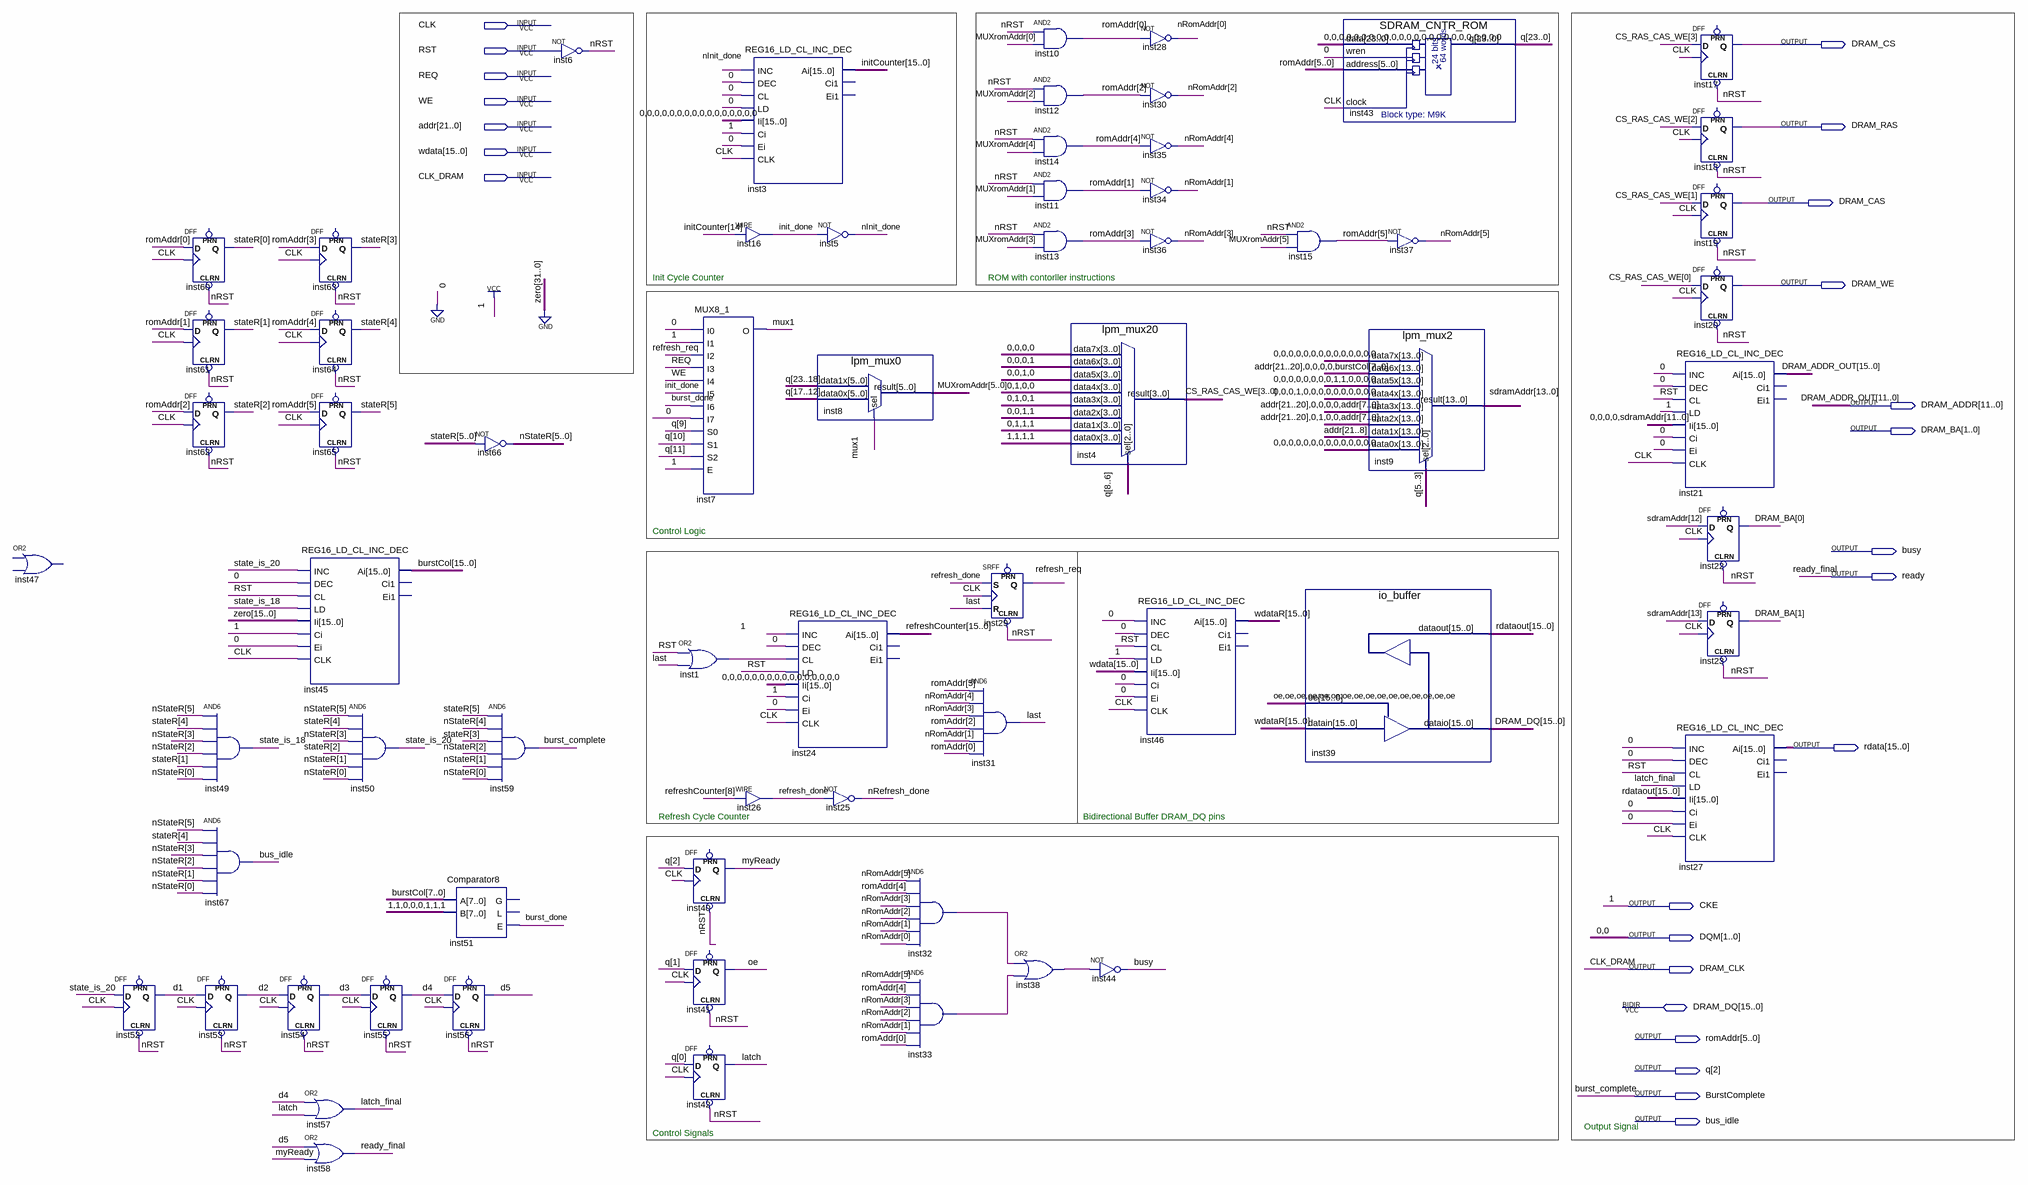
[diagram p0: schematic sheet]
// Quartus schematic SDRAM_CNTR.bdf as structural Verilog: 65 symbols, 24 pins
module SDRAM_CNTR (
  input  CLK,
  input  RST,
  input  REQ,
  input  WE,
  input  [21:0] addr,
  input  [15:0] wdata,
  input  CLK_DRAM,
  inout  [15:0] DRAM_DQ,
  output DRAM_CS,
  output DRAM_RAS,
  output DRAM_CAS,
  output DRAM_WE,
  output [11:0] DRAM_ADDR,
  output [1:0] DRAM_BA,
  output busy,
  output ready,
  output [15:0] rdata,
  output CKE,
  output [1:0] DQM,
  output DRAM_CLK,
  output [5:0] romAddr,
  output [23:0] q,
  output BurstComplete,
  output bus_idle
);

  wire burst_done, d1, d2, d3, d4, d5, init_done, inst1_out, inst32_out, inst33_out, inst38_out, last, latch,
       latch_final, mux1, myReady, nInit_done, nRefresh_done, nRST, oe, refresh_done, refresh_req,
       state_is_18, state_is_20;
  wire [3:0] CS_RAS_CAS_WE;
  wire [5:0] MUXromAddr, nRomAddr, nStateR, stateR;
  wire [13:0] sdramAddr;
  wire [15:0] burstCol, initCounter, rdataout, refreshCounter, wdataR;
  wire [15:12] DRAM_ADDR_OUT;

  // OR2 inst47 is placed but not wired
  DFF inst52 (.CLRN(nRST), .CLK(CLK), .D(state_is_20), .Q(d1));  // open: PRN
  DFF inst60 (.CLRN(nRST), .CLK(CLK), .D(romAddr[0]), .Q(stateR[0]));  // open: PRN
  DFF inst61 (.CLRN(nRST), .CLK(CLK), .D(romAddr[1]), .Q(stateR[1]));  // open: PRN
  DFF inst62 (.CLRN(nRST), .CLK(CLK), .D(romAddr[2]), .Q(stateR[2]));  // open: PRN
  and inst49 (state_is_18, nStateR[5], stateR[4], nStateR[3], nStateR[2], stateR[1], nStateR[0]);
  and inst67 (bus_idle, nStateR[5], stateR[4], nStateR[3], nStateR[2], nStateR[1], nStateR[0]);
  DFF inst53 (.CLRN(nRST), .CLK(CLK), .D(d1), .Q(d2));  // open: PRN
  DFF inst54 (.CLRN(nRST), .CLK(CLK), .D(d2), .Q(d3));  // open: PRN
  DFF inst63 (.CLRN(nRST), .CLK(CLK), .D(romAddr[3]), .Q(stateR[3]));  // open: PRN
  DFF inst64 (.CLRN(nRST), .CLK(CLK), .D(romAddr[4]), .Q(stateR[4]));  // open: PRN
  DFF inst65 (.CLRN(nRST), .CLK(CLK), .D(romAddr[5]), .Q(stateR[5]));  // open: PRN
  REG16_LD_CL_INC_DEC inst45 (
    .INC(state_is_20), .DEC(1'b0), .CL(RST), .LD(state_is_18), .Ii({16{1'b0}}), .Ci(1'b1), .Ei(1'b0),
    .CLK(CLK), .Ai(burstCol));  // open: Ci1, Ei1
  or inst57 (latch_final, d4, latch);
  or inst58 (ready, d5, myReady);
  and inst50 (state_is_20, nStateR[5], stateR[4], nStateR[3], stateR[2], nStateR[1], nStateR[0]);
  DFF inst55 (.CLRN(nRST), .CLK(CLK), .D(d3), .Q(d4));  // open: PRN
  assign nStateR = ~stateR;  // NOT inst66, 6 bits wide
  and inst59 (BurstComplete, stateR[5], nStateR[4], stateR[3], nStateR[2], nStateR[1], nStateR[0]);
  Comparator8 inst51 (.A(burstCol[7:0]), .B(8'b11000111), .E(burst_done));  // open: G, L
  DFF inst56 (.CLRN(nRST), .CLK(CLK), .D(d4), .Q(d5));  // open: PRN
  not inst6 (nRST, RST);
  MUX8_1 inst7 (
    .I0(1'b0), .I1(1'b1), .I2(refresh_req), .I3(REQ), .I4(WE), .I5(init_done), .I6(burst_done), .I7(1'b0),
    .S0(q[9]), .S1(q[10]), .S2(q[11]), .E(1'b1), .O(mux1));
  or inst1 (inst1_out, RST, last);
  DFF inst40 (.CLRN(nRST), .CLK(CLK), .D(q[2]), .Q(myReady));  // open: PRN
  DFF inst41 (.CLRN(nRST), .CLK(CLK), .D(q[1]), .Q(oe));  // open: PRN
  DFF inst42 (.CLRN(nRST), .CLK(CLK), .D(q[0]), .Q(latch));  // open: PRN
  REG16_LD_CL_INC_DEC inst3 (
    .INC(nInit_done), .DEC(1'b0), .CL(1'b0), .LD(1'b0), .Ii({16{1'b0}}), .Ci(1'b1), .Ei(1'b0), .CLK(CLK),
    .Ai(initCounter));  // open: Ci1, Ei1
  assign init_done = initCounter[14];  // WIRE inst16
  assign refresh_done = refreshCounter[8];  // WIRE inst26
  REG16_LD_CL_INC_DEC inst24 (
    .INC(1'b1), .DEC(1'b0), .CL(inst1_out), .LD(RST), .Ii({16{1'b0}}), .Ci(1'b1), .Ei(1'b0), .CLK(CLK),
    .Ai(refreshCounter));  // open: Ci1, Ei1
  not inst5 (nInit_done, init_done);
  lpm_mux0 inst8 (.data1x(q[23:18]), .data0x(q[17:12]), .sel(mux1), .result(MUXromAddr));
  not inst25 (nRefresh_done, refresh_done);
  and inst32 (inst32_out, nRomAddr[5], romAddr[4], nRomAddr[3], nRomAddr[2], nRomAddr[1], nRomAddr[0]);
  and inst33 (inst33_out, nRomAddr[5], romAddr[4], nRomAddr[3], nRomAddr[2], nRomAddr[1], romAddr[0]);
  SRFF inst29 (.CLRN(nRST), .S(refresh_done), .R(last), .CLK(CLK), .Q(refresh_req));  // open: PRN
  and inst31 (last, romAddr[5], nRomAddr[4], nRomAddr[3], romAddr[2], nRomAddr[1], romAddr[0]);
  and inst10 (romAddr[0], nRST, MUXromAddr[0]);
  and inst12 (romAddr[2], nRST, MUXromAddr[2]);
  and inst14 (romAddr[4], nRST, MUXromAddr[4]);
  and inst11 (romAddr[1], nRST, MUXromAddr[1]);
  and inst13 (romAddr[3], nRST, MUXromAddr[3]);
  or inst38 (inst38_out, inst32_out, inst33_out);
  lpm_mux20 inst4 (
    .data7x(4'b0000), .data6x(4'b0001), .data5x(4'b0010), .data4x(4'b0100), .data3x(4'b0101),
    .data2x(4'b0011), .data1x(4'b0111), .data0x(4'b1111), .sel(q[8:6]), .result(CS_RAS_CAS_WE));
  not inst44 (busy, inst38_out);
  not inst28 (nRomAddr[0], romAddr[0]);
  not inst30 (nRomAddr[2], romAddr[2]);
  not inst35 (nRomAddr[4], romAddr[4]);
  not inst34 (nRomAddr[1], romAddr[1]);
  not inst36 (nRomAddr[3], romAddr[3]);
  REG16_LD_CL_INC_DEC inst46 (
    .INC(1'b0), .DEC(1'b0), .CL(RST), .LD(1'b1), .Ii(wdata), .Ci(1'b0), .Ei(1'b0), .CLK(CLK), .Ai(wdataR));  // open: Ci1, Ei1
  and inst15 (romAddr[5], nRST, MUXromAddr[5]);
  SDRAM_CNTR_ROM inst43 (.data({24{1'b0}}), .wren(1'b0), .address(romAddr), .clock(CLK), .q(q));
  io_buffer inst39 (.datain(wdataR), .oe({16{oe}}), .dataout(rdataout), .dataio(DRAM_DQ));
  not inst37 (nRomAddr[5], romAddr[5]);
  lpm_mux2 inst9 (
    .data7x({14{1'b0}}), .data6x({addr[21:20], 4'b0000, burstCol[7:0]}), .data5x(14'b00000000110000),
    .data4x(14'b00010000000000), .data3x({addr[21:20], 4'b0000, addr[7:0]}),
    .data2x({addr[21:20], 4'b0100, addr[7:0]}), .data1x(addr[21:8]), .data0x({14{1'b0}}), .sel(q[5:3]),
    .result(sdramAddr));
  DFF inst17 (.CLRN(nRST), .CLK(CLK), .D(CS_RAS_CAS_WE[3]), .Q(DRAM_CS));  // open: PRN
  DFF inst18 (.CLRN(nRST), .CLK(CLK), .D(CS_RAS_CAS_WE[2]), .Q(DRAM_RAS));  // open: PRN
  DFF inst19 (.CLRN(nRST), .CLK(CLK), .D(CS_RAS_CAS_WE[1]), .Q(DRAM_CAS));  // open: PRN
  DFF inst20 (.CLRN(nRST), .CLK(CLK), .D(CS_RAS_CAS_WE[0]), .Q(DRAM_WE));  // open: PRN
  REG16_LD_CL_INC_DEC inst21 (
    .INC(1'b0), .DEC(1'b0), .CL(RST), .LD(1'b1), .Ii({4'b0000, sdramAddr[11:0]}), .Ci(1'b0), .Ei(1'b0),
    .CLK(CLK), .Ai({DRAM_ADDR_OUT, DRAM_ADDR}));  // open: Ci1, Ei1
  DFF inst22 (.CLRN(nRST), .CLK(CLK), .D(sdramAddr[12]), .Q(DRAM_BA[0]));  // open: PRN
  DFF inst23 (.CLRN(nRST), .CLK(CLK), .D(sdramAddr[13]), .Q(DRAM_BA[1]));  // open: PRN
  REG16_LD_CL_INC_DEC inst27 (
    .INC(1'b0), .DEC(1'b0), .CL(RST), .LD(latch_final), .Ii(rdataout), .Ci(1'b0), .Ei(1'b0), .CLK(CLK),
    .Ai(rdata));  // open: Ci1, Ei1

  assign CKE = 1'b1;
  assign DQM = 2'b00;
  assign DRAM_CLK = CLK_DRAM;

  // Other names for the same wires on the sheet: burst_complete = BurstComplete; DRAM_ADDR_OUT[11:0] = DRAM_ADDR;
  //   ready_final = ready

  // Notes on the sheet:
  //   Init Cycle Counter
  //   ROM with contorller instructions
  //   Control Logic
  //   Refresh Cycle Counter
  //   Bidirectional Buffer DRAM_DQ pins
  //   Output Signal
  //   Control Signals
endmodule
